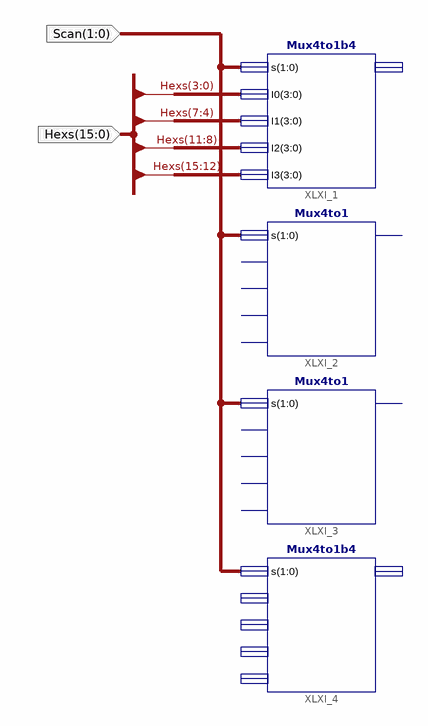
[diagram p0: schematic sheet 1]
// Xilinx ISE schematic DisplaySync.sch (kintex7) as structural Verilog: 4 symbols, 2 ports
module DisplaySync (
  input  [15:0] Hexs,
  input  [1:0] Scan
);

  Mux4to1b4 XLXI_1 (.I0(Hexs[3:0]), .I1(Hexs[7:4]), .I2(Hexs[11:8]), .I3(Hexs[15:12]), .s(Scan));  // open: o
  Mux4to1 XLXI_2 (.s(Scan));  // open: I0, I1, I2, I3, o
  Mux4to1 XLXI_3 (.s(Scan));  // open: I0, I1, I2, I3, o
  Mux4to1b4 XLXI_4 (.s(Scan));  // open: I0, I1, I2, I3, o
endmodule
